# Altium schematic sheet Sheet1.SchDoc
size A3; SheetNumber: 1; SheetTotal: 1
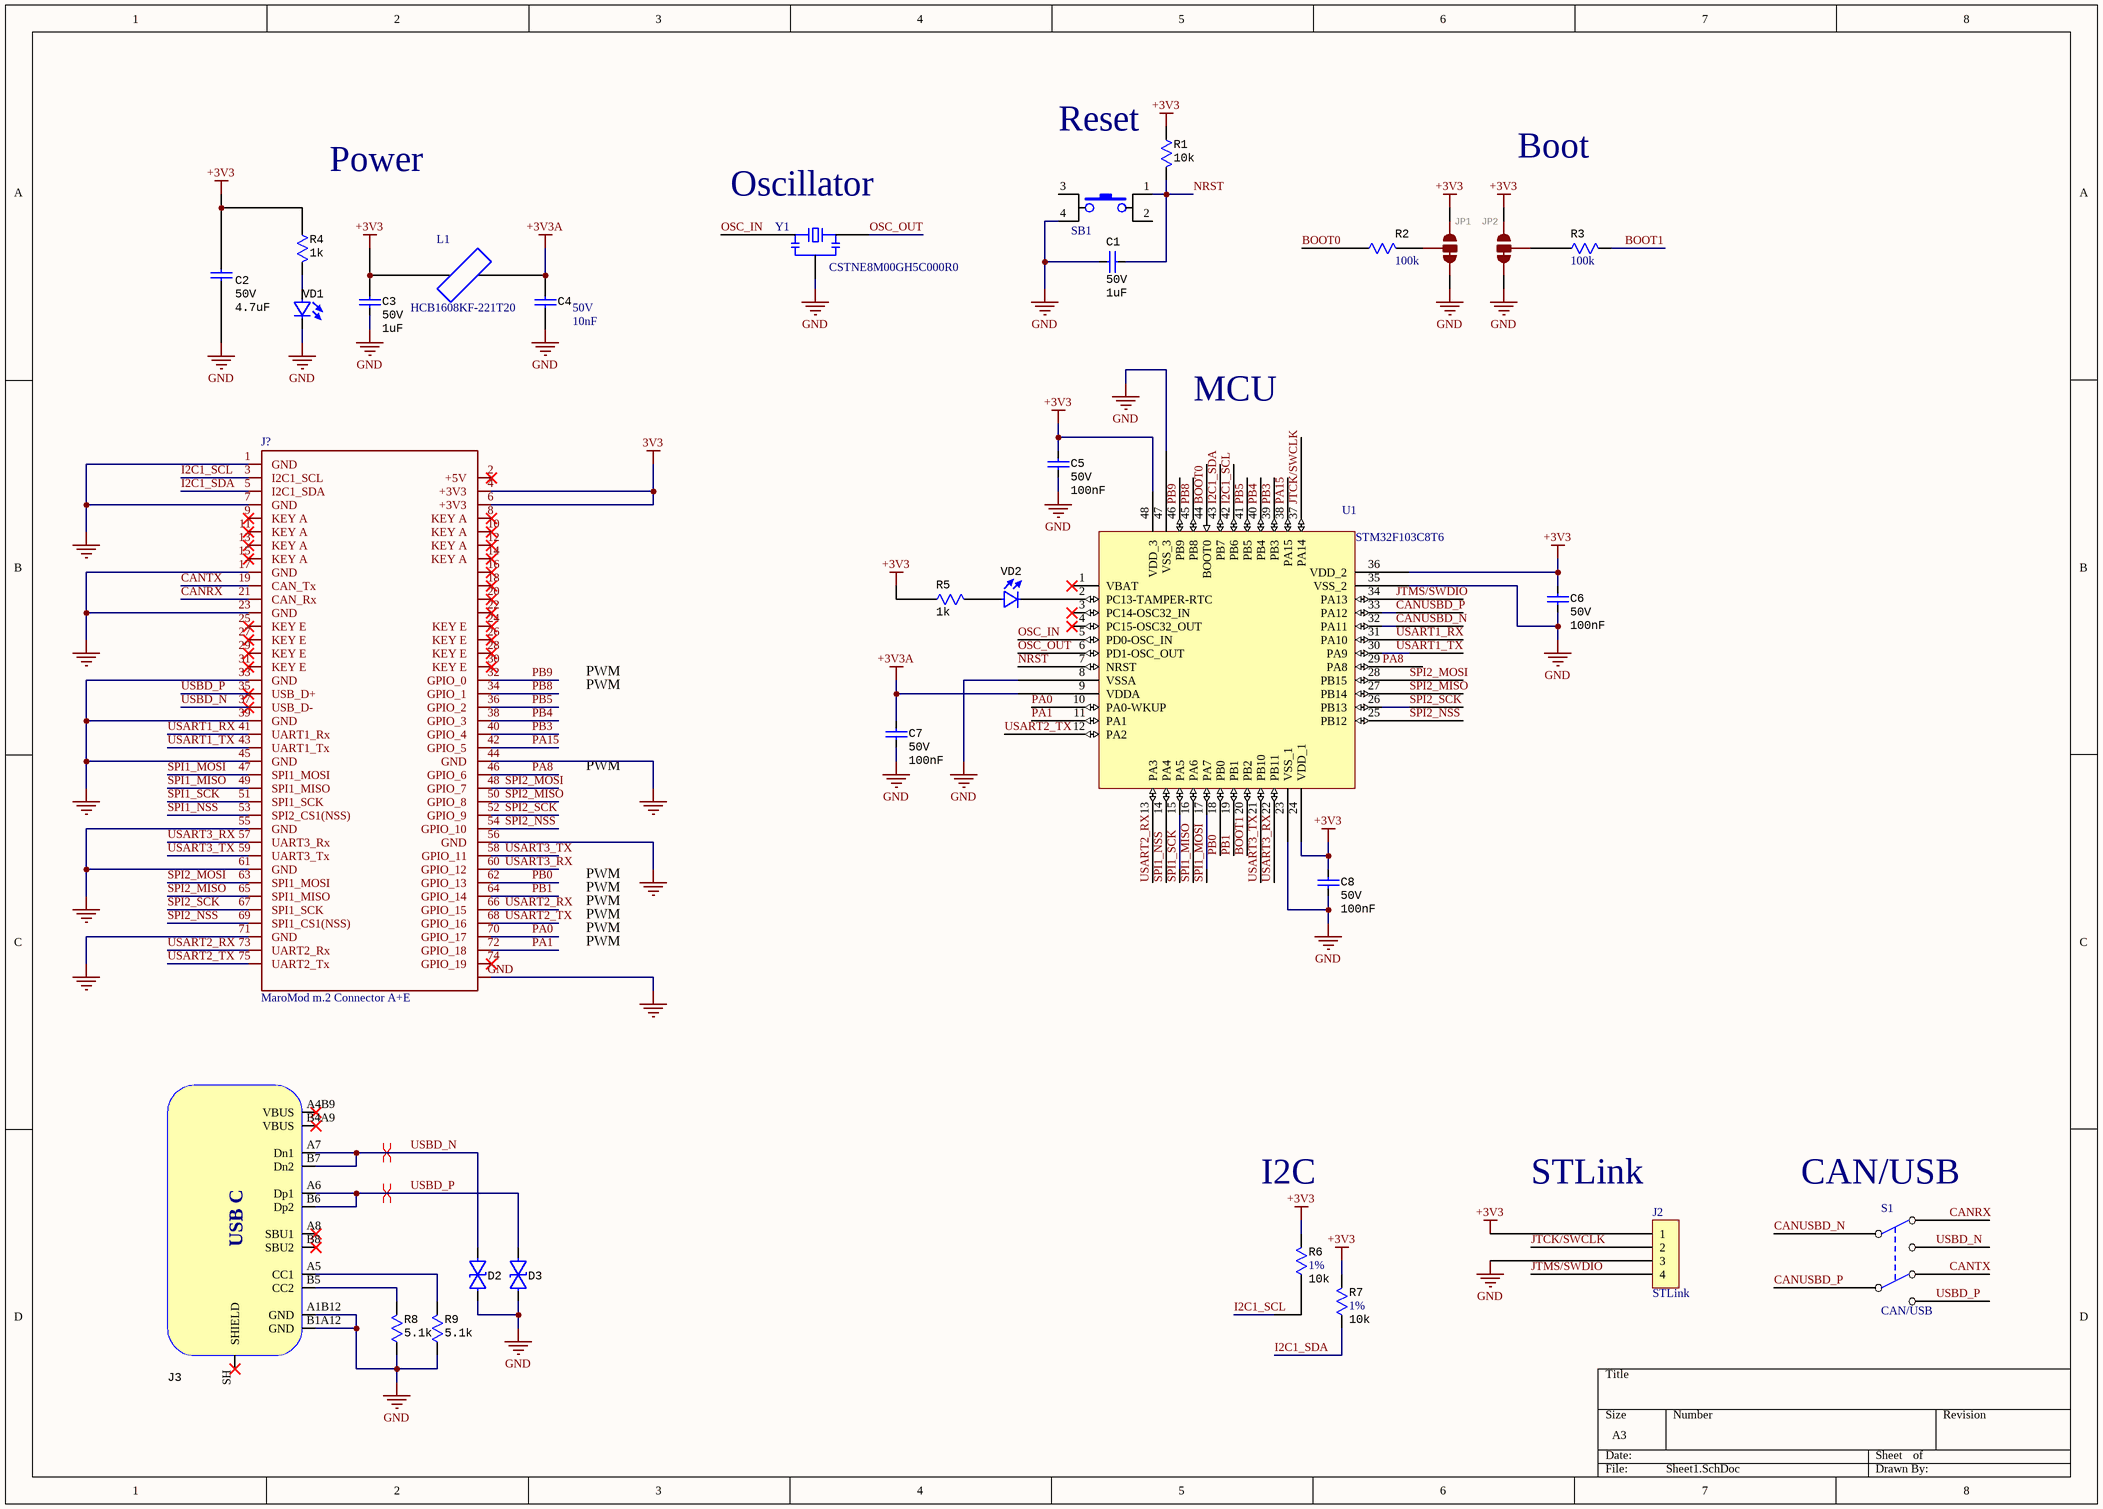
[diagram p0: Sheet1.SchDoc]

## Parts
C1  value 1uF  Voltage: 50V  [CAP Ceramic SMD 0603]  (hidden comment: CAP 0603 1uF 50V)
C2  value 4.7uF  Voltage: 50V  [CAP Ceramic SMD 1206]  (hidden comment: CAP 1206 4.7uF 50V)
C3  value 1uF  Voltage: 50V  [CAP Ceramic SMD 0603]  (hidden comment: CAP 0603 1uF 50V)
C4  10nF  Voltage Rating (DC): 50V  [CAP Ceramic SMD 0603]
C5  value 100nF  Voltage: 50V  [CAP Ceramic SMD 0603]  (hidden comment: CAP 0603 100nF 50V)
C6  value 100nF  Voltage: 50V  [CAP Ceramic SMD 0603]  (hidden comment: CAP 0603 100nF 50V)
C7  value 100nF  Voltage: 50V  [CAP Ceramic SMD 0603]  (hidden comment: CAP 0603 100nF 50V)
C8  value 100nF  Voltage: 50V  [CAP Ceramic SMD 0603]  (hidden comment: CAP 0603 100nF 50V)
D2  (no value)  [Diode Single SMD SOD523]
D3  (no value)  [Diode Single SMD SOD523]
J2  STLink  [XH-4/2.5mm]
J3  Connector_USB_Type_C_12Pin  [USB-C-31-M-12 (12PIN)]  (value not drawn)
J?  MaroMod m.2 Connector A+E  [KEY A+E Screw]  (no BOM)
JP1  JUMPER-SMT_3_1-NC_TRACE_NO-SILK  [SMT-JUMPER_3_1-NC_TRACE_NO-SILK]  (value not drawn)
JP2  JUMPER-SMT_3_1-NC_TRACE_NO-SILK  [SMT-JUMPER_3_1-NC_TRACE_NO-SILK]  (value not drawn)
L1  HCB1608KF-221T20  [HCB1608KF-221T20]
R1  value 10k  [RES SMD 0603]  (hidden comment: RES 0603 10k 1%)
R2  100k  [RES SMD 0603]
R3  100k  [RES SMD 0603]
R4  value 1k  [RES SMD 0603]  (hidden comment: RES 0603 1k 1%)
R5  value 1k  [RES SMD 0603]  (hidden comment: RES 0603 1k 1%)
R6  value 10k  Tolerance: 1%  [RES SMD 0603]  (hidden comment: RES 0603 10k 1%)
R7  value 10k  Tolerance: 1%  [RES SMD 0603]  (hidden comment: RES 0603 10k 1%)
R8  value 5.1k  [RES SMD 0603]  (hidden comment: 5.1kR)
R9  value 5.1k  [RES SMD 0603]  (hidden comment: 5.1kR)
S1  CAN/USB  [SWP-SS-22H07-G5]
SB1  TS-1187A-B-A-B  [SW-SMD-4X4X1.5]  (value not drawn)
U1  STM32F103C8T6  [STM-LQFP48_N]
VD1  (no value)  [LED SMD 0805R]
VD2  (no value)  [LED SMD 0805G]
Y1  CSTNE8M00GH5C000R0  [Crystal SMD 3-PIN 3213-3P]

## Nets
3V3: J?.4(+3V3) J?.6(+3V3)
+3V3: C2.1 C3.1 C5.1 C6.1 C8.1 J2.1 JP1.1 JP2.1 L1.2 R1.1 R4.1 R5.1 R6.2 R7.2 U1.24(VDD_1) U1.36(VDD_2) U1.48(VDD_3)
+3V3A: C4.1 C7.1 L1.1 U1.9(VDDA)
GND: C1.2 C2.2 C3.2 C4.2 C5.2 C6.2 C7.2 C8.2 D2.1 D3.1 J2.3 J3.A1B12(GND) J3.B1A12(GND) J?.1(GND) J?.7(GND) J?.17(GND) J?.23(GND) J?.33(GND) J?.39(GND) J?.44(GND) J?.45(GND) J?.55(GND) J?.56(GND) J?.61(GND) J?.71(GND) J?.GND JP1.3 JP2.3 R8.1 R9.1 SB1.4 U1.8(VSSA) U1.23(VSS_1) U1.35(VSS_2) U1.47(VSS_3) VD1.2 Y1.2
BOOT0: R2.1 U1.44(BOOT0)
BOOT1: R3.1 U1.20(PB2)
CANRX: J?.21(CAN_Rx) S1.1
CANTX: J?.19(CAN_Tx) S1.6
CANUSBD_N: S1.2 U1.32(PA11)
CANUSBD_P: S1.5 U1.33(PA12)
I2C1_SCL: J?.3(I2C1_SCL) R6.1 U1.42(PB6)
I2C1_SDA: J?.5(I2C1_SDA) R7.1 U1.43(PB7)
JTCK/SWCLK: J2.2 U1.37(PA14)
JTMS/SWDIO: J2.4 U1.34(PA13)
NRST: C1.1 R1.2 SB1.1 U1.7(NRST)
OSC_IN: U1.5(PD0-OSC_IN) Y1.1
OSC_OUT: U1.6(PD1-OSC_OUT) Y1.3
PA0: J?.70(GPIO_17) U1.10(PA0-WKUP)
PA1: J?.72(GPIO_18) U1.11(PA1)
PA8: J?.46(GPIO_6) U1.29(PA8)
PA15: J?.42(GPIO_5) U1.38(PA15)
PB0: J?.62(GPIO_13) U1.18(PB0)
PB1: J?.64(GPIO_14) U1.19(PB1)
PB3: J?.40(GPIO_4) U1.39(PB3)
PB4: J?.38(GPIO_3) U1.40(PB4)
PB5: J?.36(GPIO_2) U1.41(PB5)
PB8: J?.34(GPIO_1) U1.45(PB8)
PB9: J?.32(GPIO_0) U1.46(PB9)
SPI1_MISO: J?.49(SPI1_MISO) U1.16(PA6)
SPI1_MOSI: J?.47(SPI1_MOSI) U1.17(PA7)
SPI1_NSS: J?.53(SPI2_CS1(NSS)) U1.14(PA4)
SPI1_SCK: J?.51(SPI1_SCK) U1.15(PA5)
SPI2_MISO: J?.50(GPIO_8) J?.65(SPI1_MISO) U1.27(PB14)
SPI2_MOSI: J?.48(GPIO_7) J?.63(SPI1_MOSI) U1.28(PB15)
SPI2_NSS: J?.54(GPIO_10) J?.69(SPI1_CS1(NSS)) U1.25(PB12)
SPI2_SCK: J?.52(GPIO_9) J?.67(SPI1_SCK) U1.26(PB13)
USART1_RX: J?.41(UART1_Rx) U1.31(PA10)
USART1_TX: J?.43(UART1_Tx) U1.30(PA9)
USART2_RX: J?.66(GPIO_15) J?.73(UART2_Rx) U1.13(PA3)
USART2_TX: J?.68(GPIO_16) J?.75(UART2_Tx) U1.12(PA2)
USART3_RX: J?.57(UART3_Rx) J?.60(GPIO_12) U1.22(PB11)
USART3_TX: J?.58(GPIO_11) J?.59(UART3_Tx) U1.21(PB10)
USBD_N: D2.2 J3.A7(Dn1) J3.B7(Dn2) J?.37(USB_D-) S1.3
USBD_P: D3.2 J3.A6(Dp1) J3.B6(Dp2) J?.35(USB_D+) S1.4
NetJ3_A5: J3.A5(CC1) R9.2
NetJ3_B5: J3.B5(CC2) R8.2
NetJP1_2: JP1.2 R2.2
NetJP2_2: JP2.2 R3.2
NetR4_2: R4.2 VD1.1
NetR5_2: R5.2 VD2.1
NetU1_2: U1.2(PC13-TAMPER-RTC) VD2.2

Not connected (* = marked no-connect by the designer): J3 A4B9(VBUS)* A8(SBU1)* B4A9(VBUS)* B8(SBU2)* SH(SHIELD)*; J? 2(+5V)* 8(KEY_A)* 9(KEY_A)* 10(KEY_A)* 11(KEY_A)* 12(KEY_A)* 13(KEY_A)* 14(KEY_A)* 15(KEY_A)* 16* 18* 20* 22* 24(KEY_E)* 25(KEY_E)* 26(KEY_E)* 27(KEY_E)* 28(KEY_E)* 29(KEY_E)* 30(KEY_E)* 31(KEY_E)* 74(GPIO_19)*; SB1 2 3; U1 1(VBAT)* 3(PC14-OSC32_IN)* 4(PC15-OSC32_OUT)*

## Layout directives
differential pair: USBD_N, USBD_P

## Notes on the sheet
- Power
- (near R1) Reset
- Boot
- (near Y1) Oscillator
- MCU
- PWM
- (near R6) I2C
- (near J2) STLink
- (near S1) CAN/USB
- (in symbol Connector_USB_Type_C_12Pin) USB C

## Library data of the parts
C1 C3 = CAP 0603 1uF 50V: 0603 1 uF 50 V ±10% Tolerance X5R SMT Multilayer Ceramic Capacitor; Manufacturer: Murata; Manufacturer Part Number: GRM188R61H105KAALD; Dielectric: X7R; Tolerance: 10%; Supplier 1: LCSC; Supplier Part Number 1: C77386; RoHS: Yes; Category: Ceramic Capacitors; Stock 1: 2200; Pricing 1: 50=0.01970, 500=0.01600, 1500=0.01390, 5000=0.01050, 25000=0.00960, 50000=0.00910 (USD); Mount: Surface Mount; Case/Package: 0603; Case Code (Imperial): 0603; Case Code (Metric): 1608; Min Operating Temperature: -55°C; Max Operating Temperature: 85°C; Capacitance: 1uF; Voltage Rating: 50V; Voltage Rating (DC): 50V; Packaging: Tape and Reel; Package Quantity: 4000; Termination: SMD/SMT; Series: GRM; Construction: Flat; Length: 1.6mm; Width: 0.8mm; Height: 0.8mm; Thickness: 0.035inch; Depth: 0.8mm; Radiation Hardening: No; RoHS Compliant: Yes; REACH SVHC: No SVHC; ComponentLink1URL: https://datasheet.ciiva.com/23628/1522414-23628576.pdf?src-supplier=Newark; ComponentLink1Description: https://datasheet.ciiva.com/23628/1522414-23628576.pdf?src-supplier=Newark; ComponentLink2URL: https://datasheet.ciiva.com/22706/1747450-22706788.pdf?src-supplier=Element14; ComponentLink2Description: https://datasheet.ciiva.com/22706/1747450-22706788.pdf?src-supplier=Element14; ComponentLink3URL: https://datasheet.ciiva.com/14116/grmseries-highdielectrictype-eng-14116381.pdf?src-supplier=Distrelec; ComponentLink3Description: https://datasheet.ciiva.com/14116/grmseries-highdielectrictype-eng-14116381.pdf?src-supplier=Distrelec; Weight: 0.000222oz; Resistor Type: Ceramic; Lead Free: Lead Free; ComponentLink4URL: https://datasheet.ciiva.com/7719/1747450-7719046.pdf?src-supplier=Element14; ComponentLink4Description: https://datasheet.ciiva.com/7719/1747450-7719046.pdf?src-supplier=Element14; Material: Ceramic
C2 = CAP 1206 4.7uF 50V: CAP CER 4.7UF 50V X7R 1206; Manufacturer: Murata; Manufacturer Part Number: GRM31CR71H475KA12L; Tolerance: 10%; Material: Ceramic; Supplier 1: Arrow Electronics; RoHS: Yes; Category: Ceramic Capacitors; Stock 1: 80556; Pricing 1: 1=0.38790, 10=0.28280, 25=0.25560, 100=0.19830, 250=0.18090, 500=0.15290, 1000=0.12970, 3000=0.09130, 6000=0.08180, 15000=0.08090, 30000=0.07980, 75000=0.07380 (USD); Mount: Surface Mount; Case/Package: 1206; Case Code (Metric): 3216; Case Code (Imperial): 1206; Min Operating Temperature: -55°C; Max Operating Temperature: 125°C; Package Quantity: 2000; Capacitance: 4.7uF; Voltage Rating: 50V; Packaging: Tape and Reel; Series: GRM; Length: 3.2mm; Width: 0.063inch; Lead Free: Lead Free; RoHS Compliant: Yes; ComponentLink1URL: https://datasheet.ciiva.com/6072/415379-6072784.pdf?src-supplier=Farnell; ComponentLink1Description: https://datasheet.ciiva.com/6072/415379-6072784.pdf?src-supplier=Farnell; ComponentLink2URL: https://datasheet.ciiva.com/3777/2267grm31cr71h475ka1223-3777241.pdf?src-supplier=Arrow+Electronics; ComponentLink2Description: https://datasheet.ciiva.com/3777/2267grm31cr71h475ka1223-3777241.pdf?src-supplier=Arrow+Electronics; ComponentLink3URL: https://datasheet.ciiva.com/29202/450972-da-01-de-vs-chip-kond-1206-4-7-uf-10pr-50-0v-x7r-29202576.pdf?src-supplier=Conrad; ComponentLink3Description: https://datasheet.ciiva.com/29202/450972-da-01-de-vs-chip-kond-1206-4-7-uf-10pr-50-0v-x7r-29202576.pdf?src-supplier=Conrad; Voltage Rating (DC): 50V; Dielectric: X7R; Termination: SMD/SMT; Construction: Flat; Height: 1.6mm; Thickness: 0.071inch; Depth: 1.6mm; Radiation Hardening: No; REACH SVHC: No SVHC; ComponentLink4URL: https://datasheet.ciiva.com/29202/451279-da-01-de-vs-kondens-grm31-cr71h-475ka12l-29202365.pdf?src-supplier=Conrad; ComponentLink4Description: https://datasheet.ciiva.com/29202/451279-da-01-de-vs-kondens-grm31-cr71h-475ka12l-29202365.pdf?src-supplier=Conrad; ComponentLink5URL: https://datasheet.ciiva.com/7937/415310-7937749.pdf?src-supplier=Element14; ComponentLink5Description: https://datasheet.ciiva.com/7937/415310-7937749.pdf?src-supplier=Element14; ComponentLink6URL: https://datasheet.ciiva.com/6270/partnumbering-e-01-6270218.pdf?src-supplier=Digi-Key; ComponentLink6Description: https://datasheet.ciiva.com/6270/partnumbering-e-01-6270218.pdf?src-supplier=Digi-Key; ComponentLink7URL: https://datasheet.ciiva.com/6270/partnumbering-e-01-6270217.pdf?src-supplier=Digi-Key; ComponentLink7Description: https://datasheet.ciiva.com/6270/partnumbering-e-01-6270217.pdf?src-supplier=Digi-Key; ComponentLink8URL: https://datasheet.ciiva.com/6270/partnumbering-e-01-6270219.pdf?src-supplier=Digi-Key; ComponentLink8Description: https://datasheet.ciiva.com/6270/partnumbering-e-01-6270219.pdf?src-supplier=Digi-Key; Supplier Part Number 1: GRM31CR71H475KA12L; Supplier 2: LCSC; Stock 2: 656560; Pricing 2: 10=0.05080, 100=0.04090, 300=0.03590, 1000=0.03170, 5000=0.03030, 10000=0.02930 (USD); Supplier Part Number 2: C77096
C4 = CAP 0603 10nF 50V: 0603 10nF 50V ±10% Tolerance X7R Surface Mount Multilayer Ceramic Capacitor; Manufacturer: Kyocera AVX; Manufacturer Part Number: 06035C103K4T2A; Dissipation Factor: 2.5%; Supplier 1: LCSC; RoHS: Yes; Category: Ceramic Capacitors; Stock 1: 4600; Pricing 1: 50=0.012500, 500=0.010300, 1500=0.009100, 5000=0.008400, 25000=0.007800, 50000=0.007400 (AUD); Case/Package: 0603; Case Code (Imperial): 0603; Case Code (Metric): 1608; Min Operating Temperature: -55°C; Max Operating Temperature: 125°C; Tolerance: 10%; Packaging: Tape and Reel; Dielectric: X7R; Termination: SMD/SMT; Series: -; Length: 1.6mm; Width: 0.032inch; RoHS Compliant: Yes; ComponentLink1URL: https://datasheet.ciiva.com/16425/cauto-16425973.pdf?src-supplier=Future+Electronics; ComponentLink1Description: https://datasheet.ciiva.com/16425/cauto-16425973.pdf?src-supplier=Future+Electronics; Capacitance: 10nF; ComponentLink2Description: https://datasheet.ciiva.com/206/cauto-206886.pdf?src-supplier=Digi-Key; ComponentLink2URL: https://datasheet.ciiva.com/206/cauto-206886.pdf?src-supplier=Digi-Key; ComponentLink3Description: https://datasheet.ciiva.com/7614/cauto-7614648.pdf?src-supplier=Digi-Key; ComponentLink3URL: https://datasheet.ciiva.com/7614/cauto-7614648.pdf?src-supplier=Digi-Key; ComponentLink4Description: https://datasheet.ciiva.com/14891/cauto-14891051.pdf?src-supplier=Digi-Key; ComponentLink4URL: https://datasheet.ciiva.com/14891/cauto-14891051.pdf?src-supplier=Digi-Key; ComponentLink5Description: https://datasheet.ciiva.com/7855/88813-7855228.pdf?src-supplier=Element14; ComponentLink5URL: https://datasheet.ciiva.com/7855/88813-7855228.pdf?src-supplier=Element14; ComponentLink6Description: https://datasheet.ciiva.com/14891/cauto-14891052.pdf?src-supplier=Digi-Key; ComponentLink6URL: https://datasheet.ciiva.com/14891/cauto-14891052.pdf?src-supplier=Digi-Key; ComponentLink7Description: https://datasheet.ciiva.com/11499/cauto-11499678.pdf?src-supplier=Avnet; ComponentLink7URL: https://datasheet.ciiva.com/11499/cauto-11499678.pdf?src-supplier=Avnet; Construction: Flat; Contact Plating: Tin,Matte; Depth: 0.81mm; Height: 0.9mm; Lead Free: Lead Free; Mount: Surface Mount; Number of Pins: 2; Package Quantity: 1; Radiation Hardening: No; Ratings: AEC-Q200; REACH SVHC: No SVHC; Supplier Part Number 1: C513325; Thickness: 0.035inch; Voltage Rating: 50V
C5-C8 = CAP 0603 100nF 50V: Multilayer Ceramic Capacitors MLCC Surface Mount 0603 0.1uF 50 Volts X7R 10%; Manufacturer: Murata; Manufacturer Part Number: GRM188R71H104KA93D; Insulation Resistance: 10GR; Supplier 1: LCSC; RoHS: Yes; Category: Ceramic Capacitors; Stock 1: 3546650; Pricing 1: 50=0.00420, 500=0.00330, 1500=0.00290, 5000=0.00260, 25000=0.00250, 50000=0.00240 (USD); Mount: Surface Mount; Case/Package: 0603; Number of Pins: 2; Case Code (Metric): 1608; Case Code (Imperial): 0603; Dielectric Material: Ceramic; Min Operating Temperature: -55°C; Max Operating Temperature: 125°C; Capacitance: 100nF; Tolerance: 10%; Packaging: Tape and Reel; Dielectric: X7R; Termination: SMD/SMT; Package Quantity: 1; Voltage Rating: 50V; Length: 1.6mm; Width: 0.8mm; Height: 0.8mm; Depth: 0.8mm; Thickness: 0.035inch; Radiation Hardening: No; RoHS Compliant: Yes; REACH SVHC: No SVHC; Lead Free: Lead Free; ComponentLink1URL: https://datasheet.ciiva.com/19467/1857604-19467681.pdf?src-supplier=Jameco; ComponentLink1Description: https://datasheet.ciiva.com/19467/1857604-19467681.pdf?src-supplier=Jameco; ComponentLink2URL: https://datasheet.ciiva.com/11786/0900766b807a1cab-11786047.pdf?src-supplier=RSComponents; ComponentLink2Description: https://datasheet.ciiva.com/11786/0900766b807a1cab-11786047.pdf?src-supplier=RSComponents; ComponentLink3URL: https://datasheet.ciiva.com/29201/451744-da-01-en-vs-kondensator-0603-29201904.pdf?src-supplier=Conrad; ComponentLink3Description: https://datasheet.ciiva.com/29201/451744-da-01-en-vs-kondensator-0603-29201904.pdf?src-supplier=Conrad; ComponentLink4URL: https://datasheet.ciiva.com/7937/4360-7937659.pdf?src-supplier=Element14; ComponentLink4Description: https://datasheet.ciiva.com/7937/4360-7937659.pdf?src-supplier=Element14; ComponentLink5URL: https://datasheet.ciiva.com/14116/nmgrm-data-en-14116602.pdf?src-supplier=Distrelec; ComponentLink5Description: https://datasheet.ciiva.com/14116/nmgrm-data-en-14116602.pdf?src-supplier=Distrelec; ComponentLink6URL: https://datasheet.ciiva.com/48436/nmgrm-data-en-48436667.pdf?src-supplier=Distrelec; ComponentLink6Description: https://datasheet.ciiva.com/48436/nmgrm-data-en-48436667.pdf?src-supplier=Distrelec; ComponentLink7URL: https://datasheet.ciiva.com/28534/4360-28534245.pdf?src-supplier=Element14; ComponentLink7Description: https://datasheet.ciiva.com/28534/4360-28534245.pdf?src-supplier=Element14; ComponentLink8URL: https://datasheet.ciiva.com/131/partnumbering-e-01-131739.pdf?src-supplier=Digi-Key; ComponentLink8Description: https://datasheet.ciiva.com/131/partnumbering-e-01-131739.pdf?src-supplier=Digi-Key; ComponentLink9URL: https://datasheet.ciiva.com/131/partnumbering-e-01-131738.pdf?src-supplier=Digi-Key; ComponentLink9Description: https://datasheet.ciiva.com/131/partnumbering-e-01-131738.pdf?src-supplier=Digi-Key; Supplier Part Number 1: C77055; ComponentLink10Description: https://datasheet.ciiva.com/131/partnumbering-e-01-131740.pdf?src-supplier=Digi-Key; ComponentLink10URL: https://datasheet.ciiva.com/131/partnumbering-e-01-131740.pdf?src-supplier=Digi-Key; ComponentLink11Description: https://datasheet.ciiva.com/7937/1747470-7937658.pdf?src-supplier=Element14; ComponentLink11URL: https://datasheet.ciiva.com/7937/1747470-7937658.pdf?src-supplier=Element14; Contact Plating: Tin,Matte; Material: Ceramic; Voltage Rating (DC): 50V
D2 D3 = LESD5D5.0CT1G: Bi-Directional 9.4A 5V 18.6V 5.6V SOD-523 ESD Protection Devices ROHS; Manufacturer: UMW(Youtai Semiconductor); Supplier 1: LCSC; Manufacturer Part Number: LESD5D5.0CT1G; RoHS: No; Category: Uncategorized; Stock 1: 13940; Pricing 1: 20=0.02140, 200=0.01710, 600=0.01470, 3000=0.01330, 9000=0.01330, 21000=0.01330 (USD); Supplier Part Number 1: C5199850
J2 = JST 4: MaleHeader 4x1
J3 = Connector_USB_Type_C_12Pin: Korean Hroparts Elec / USB-Type-C / Num of contacts 16 / Surface Mount; ManufacturerPartNumber: TYPE-C-31-M-12; SuplierPartNumber: C165948; TypeConnector: USB Type C; CurrentMax: 3A; Manufacturer: Korean Hroparts; HelpURL: https://lcsc.com/product-detail/USB-Type-C_Korean-Hroparts-Elec-TYPE-C-31-M-12_C165948.html
JP1 JP2 = JUMPER-SMT_3_1-NC_TRACE_NO-SILK: Normally closed trace jumper (1 of 2 connections)    This jumper has a trace between two pads so it's normally closed (NC). The other connection is normally open (NO). Use a razor knife to open the connection. For best results follow the IPC guidelines for cutting traces: Cutout at least 0.063 mm (0.005 in).  Remove all loose material to clean up the cut area.  Seal the cut with an approved epoxy.       Reapply solder to reclose the connection, or to close the NO connection.; GateName_1: G$1; SymbolName_1: SMT-JUMPER_3_1-NC_TRACE; DeviceName: _NO-SILK; LibraryName: SparkFun-Jumpers; DeviceSetName: JUMPER-SMT_3_1-NC_TRACE; Package: SMT-JUMPER_3_1-NC_TRACE_NO-SILK
L1 = Ferrite-Bead: 2A 1 100mΩ 220Ω@100MHz ±25% 0603 Ferrite Beads ROHS; Manufacturer: TAI-TECH; Package: 0603; ComponentLink1Description: LCSC; ComponentLink1URL: https://www.lcsc.com/product-detail/Ferrite-Beads_TAI-TECH-HCB1608KF-221T20_C304314.html; Part Number: HCB1608KF-221T20; Supplier: LCSC; Supplier part number: C304314
R1 R6 R7 = RES 0603 10k 1%: Res Thick Film 0603 10K Ohm 1% 1/10W ±100ppm/°C Molded SMD Punched Carrier T/R; Manufacturer: Panasonic; Manufacturer Part Number: ERJ-3EKF1002V; Power Rating: 100mW; Resistance: 10kR; Voltage Rating: 75V; Supplier 1: LCSC; Supplier Part Number 1: C191124; RoHS: Yes; Category: Chip SMD Resistors; Stock 1: 555600; Pricing 1: 50=0.010200, 500=0.008400, 1500=0.007300, 5000=0.006100, 25000=0.005500, 50000=0.005400 (AUD); Mount: Surface Mount; Case/Package: 0603; Number of Pins: 2; Case Code (Imperial): 0603; Case Code (Metric): 1608; Contact Plating: Tin; Size Code: 0603; Min Operating Temperature: -55°C; Max Operating Temperature: 155°C; Temperature Coefficient: 100ppm/°C; Packaging: Tape and Reel; Resistor Type: Thick Film; Series: ERJ; Package Quantity: 1; Termination: SMD/SMT; Voltage Rating (DC): 75V; Number of Terminations: 2; Max Power Dissipation: 100mW; Construction: Rectangular; Resistance Tolerance: 1%; Features: Automotive AEC-Q200; Technology: THICK FILM; Length: 1.6mm; Width: 0.031inch; Height: 0.45mm; Depth: 0.8mm; Radiation Hardening: No; RoHS Compliant: Yes; REACH SVHC: No SVHC; Lead Free: Lead Free; Military Standard: Not; ComponentLink1URL: https://datasheet.ciiva.com/7830/aoa0000ce2-7830729.pdf?src-supplier=Element14; ComponentLink1Description: https://datasheet.ciiva.com/7830/aoa0000ce2-7830729.pdf?src-supplier=Element14; ComponentLink2URL: https://datasheet.ciiva.com/46372/1678782-46372725.pdf?src-supplier=Element14; ComponentLink2Description: https://datasheet.ciiva.com/46372/1678782-46372725.pdf?src-supplier=Element14; ComponentLink3URL: https://datasheet.ciiva.com/28514/426256-28514198.pdf?src-supplier=Element14; ComponentLink3Description: https://datasheet.ciiva.com/28514/426256-28514198.pdf?src-supplier=Element14; ComponentLink4URL: https://datasheet.ciiva.com/24070/aoa0000ce2-24070318.pdf?src-supplier=Mouser; ComponentLink4Description: https://datasheet.ciiva.com/24070/aoa0000ce2-24070318.pdf?src-supplier=Mouser; ComponentLink5URL: https://datasheet.ciiva.com/16759/70260748-16759807.pdf?src-supplier=Allied+Electronics; ComponentLink5Description: https://datasheet.ciiva.com/16759/70260748-16759807.pdf?src-supplier=Allied+Electronics; ComponentLink6URL: https://datasheet.ciiva.com/9194/aoa0000ce2-9194199.pdf?src-supplier=Avnet; ComponentLink6Description: https://datasheet.ciiva.com/9194/aoa0000ce2-9194199.pdf?src-supplier=Avnet; ComponentLink7URL: https://datasheet.ciiva.com/48530/aoa0000ce2-48530988.pdf?src-supplier=Avnet; ComponentLink7Description: https://datasheet.ciiva.com/48530/aoa0000ce2-48530988.pdf?src-supplier=Avnet; ComponentLink8URL: https://datasheet.ciiva.com/30208/aoa0000ce2-30208985.pdf?src-supplier=Onlinecomponents.com; ComponentLink8Description: https://datasheet.ciiva.com/30208/aoa0000ce2-30208985.pdf?src-supplier=Onlinecomponents.com
  R1: Tolerance: 1%
R2 R3 = RES 0603 100k 1%: RES SMD 100K OHM 1% 1/10W 0603; Manufacturer: Panasonic; Manufacturer Part Number: ERJ3EKF1003V; Power Rating: 100mW; Temperature Coefficient: 100ppm/°C; Voltage Rating (DC): 75V; Supplier 1: LCSC; RoHS: Yes; Category: Chip SMD Resistors; Stock 1: 373100; Pricing 1: 50=0.00790, 500=0.00640, 1500=0.00550, 5000=0.00500, 25000=0.00460, 50000=0.00430 (USD); Mount: Surface Mount; Case/Package: 0603; Case Code (Metric): 1608; Case Code (Imperial): 0603; Contact Plating: Tin; Min Operating Temperature: -55°C; Max Operating Temperature: 155°C; Resistance: 100k; Tolerance: 1%; Packaging: Tape and Reel; Resistor Type: Thick Film; Number of Terminations: 2; Max Power Dissipation: 100mW; Features: Automotive AEC-Q200; Series: ERJ; Construction: Rectangular; Length: 1.6mm; Width: 0.8mm; Height: 0.022inch; Depth: 0.8mm; Radiation Hardening: No; Military Standard: Not; Lead Free: Lead Free; RoHS Compliant: Yes; ComponentLink1URL: https://datasheet.ciiva.com/34303/1987476-34303566.pdf?src-supplier=Jameco; ComponentLink1Description: https://datasheet.ciiva.com/34303/1987476-34303566.pdf?src-supplier=Jameco; ComponentLink2Description: https://datasheet.ciiva.com/16770/70260748-16770253.pdf?src-supplier=Allied+Electronics; ComponentLink2URL: https://datasheet.ciiva.com/16770/70260748-16770253.pdf?src-supplier=Allied+Electronics; ComponentLink3Description: https://datasheet.ciiva.com/16740/aoa0000ce2-16740662.pdf?src-supplier=Future+Electronics; ComponentLink3URL: https://datasheet.ciiva.com/16740/aoa0000ce2-16740662.pdf?src-supplier=Future+Electronics; ComponentLink4Description: https://datasheet.ciiva.com/15158/getdatasheetpartid-247527-15158907.pdf?src-supplier=Verical; ComponentLink4URL: https://datasheet.ciiva.com/15158/getdatasheetpartid-247527-15158907.pdf?src-supplier=Verical; ComponentLink5Description: https://datasheet.ciiva.com/30133/aoa0000ce2-30133845.pdf?src-supplier=Onlinecomponents.com; ComponentLink5URL: https://datasheet.ciiva.com/30133/aoa0000ce2-30133845.pdf?src-supplier=Onlinecomponents.com; Number of Pins: 2; Package Quantity: 5000; REACH SVHC: No SVHC; Resistance Tolerance: 1%; Size Code: 0603; Supplier Part Number 1: C189597; Termination: SMD/SMT; Voltage Rating: 75V; Weight: 7.1E-05oz
R4 R5 = RES 0603 1k 1%: Res Thick Film 0603 1K Ohm 1% 1/10W ±100ppm/°C Molded SMD Punched Carrier T/R; Manufacturer: Panasonic; Manufacturer Part Number: ERJ3EKF1001V; Resistance: 1kR; Power Rating: 100mW; Voltage Rating: 75V; Tolerance: 1%; Supplier 1: LCSC; RoHS: Yes; Category: Chip SMD Resistors; Stock 1: 79650; Pricing 1: 50=0.009600, 500=0.008100, 1500=0.007300, 5000=0.006800, 25000=0.006400, 50000=0.006200 (AUD); Case/Package: 0603; Case Code (Imperial): 0603; Case Code (Metric): 1608; Contact Plating: Tin; Size Code: 0603; Min Operating Temperature: -55°C; Max Operating Temperature: 155°C; Packaging: Tape and Reel; Temperature Coefficient: 100ppm/°C; Resistor Type: Thick Film; Series: ERJ; Max Power Dissipation: 100mW; Number of Terminations: 2; Construction: Rectangular; Features: Automotive AEC-Q200; Termination: SMD/SMT; Resistance Tolerance: 1%; Technology: THICK FILM; Length: 1.6mm; Height: 0.45mm; Depth: 0.8mm; Radiation Hardening: No; RoHS Compliant: Yes; Military Standard: Not; Lead Free: Lead Free; REACH SVHC: No SVHC; ComponentLink1URL: https://datasheet.ciiva.com/7942/aoa0000ce2-7942427.pdf?src-supplier=Element14; ComponentLink1Description: https://datasheet.ciiva.com/7942/aoa0000ce2-7942427.pdf?src-supplier=Element14; ComponentLink2URL: https://datasheet.ciiva.com/46373/1678782-46373340.pdf?src-supplier=Element14; ComponentLink2Description: https://datasheet.ciiva.com/46373/1678782-46373340.pdf?src-supplier=Element14; ComponentLink3URL: https://datasheet.ciiva.com/22673/1678782-22673918.pdf?src-supplier=Element14; ComponentLink3Description: https://datasheet.ciiva.com/22673/1678782-22673918.pdf?src-supplier=Element14; ComponentLink4URL: https://datasheet.ciiva.com/46373/1678782-46373339.pdf?src-supplier=Element14; ComponentLink4Description: https://datasheet.ciiva.com/46373/1678782-46373339.pdf?src-supplier=Element14; ComponentLink5URL: https://datasheet.ciiva.com/24070/aoa0000ce2-24070269.pdf?src-supplier=Mouser; ComponentLink5Description: https://datasheet.ciiva.com/24070/aoa0000ce2-24070269.pdf?src-supplier=Mouser; ComponentLink6URL: https://datasheet.ciiva.com/16768/70260748-16768437.pdf?src-supplier=Allied+Electronics; ComponentLink6Description: https://datasheet.ciiva.com/16768/70260748-16768437.pdf?src-supplier=Allied+Electronics; ComponentLink7URL: https://datasheet.ciiva.com/16774/70260748-16774550.pdf?src-supplier=Allied+Electronics; ComponentLink7Description: https://datasheet.ciiva.com/16774/70260748-16774550.pdf?src-supplier=Allied+Electronics; ComponentLink8URL: https://datasheet.ciiva.com/9198/aoa0000ce2-9198923.pdf?src-supplier=Avnet; ComponentLink8Description: https://datasheet.ciiva.com/9198/aoa0000ce2-9198923.pdf?src-supplier=Avnet; Supplier Part Number 1: C118155; ComponentLink9Description: https://datasheet.ciiva.com/16449/aoa0000ce2-16449065.pdf?src-supplier=Future+Electronics; ComponentLink9URL: https://datasheet.ciiva.com/16449/aoa0000ce2-16449065.pdf?src-supplier=Future+Electronics; ComponentLink10Description: https://datasheet.ciiva.com/48530/aoa0000ce2-48530987.pdf?src-supplier=Avnet; ComponentLink10URL: https://datasheet.ciiva.com/48530/aoa0000ce2-48530987.pdf?src-supplier=Avnet; ComponentLink11Description: https://datasheet.ciiva.com/30063/aoa0000ce2-30063390.pdf?src-supplier=Onlinecomponents.com; ComponentLink11URL: https://datasheet.ciiva.com/30063/aoa0000ce2-30063390.pdf?src-supplier=Onlinecomponents.com; Mount: Surface Mount; Number of Pins: 2; Package Quantity: 5000; Voltage Rating (DC): 75V; Width: 0.8mm
R8 R9 = RES 0603 5.1k 1%: Res Thick Film 0603 5.1K Ohm 1% 1/10W ±100ppm/°C Molded SMD SMD Paper T/R; Manufacturer: Vishay; Manufacturer Part Number: CRCW06035K10FKEA; Max Power Dissipation: 100mW; Voltage Rating (DC): 75V; Supplier 1: LCSC; RoHS: Yes; Category: Chip SMD Resistors; Stock 1: 3800; Pricing 1: 50=0.017200, 500=0.013100, 1500=0.011300, 5000=0.010700, 25000=0.009300, 50000=0.009200 (AUD); Mount: Surface Mount; Case/Package: 0603; Case Code (Imperial): 0603; Case Code (Metric): 1608; Contact Plating: Tin; Size Code: 0603; Weight: 7.1E-05oz; Min Operating Temperature: -55°C; Max Operating Temperature: 155°C; Packaging: Tape and Reel; Resistance: 5.1kR; Tolerance: 1%; Temperature Coefficient: 100ppm/°C; Resistor Type: Thick Film; Series: CRCW; Number of Terminations: 2; Package Quantity: 5000; Power Rating: 100mW; Voltage Rating: 75V; Construction: Rectangular; Features: Automotive AEC-Q200; Termination: SMD/SMT; Resistance Tolerance: 1%; Technology: THICK FILM; Length: 1.55mm; Width: 0.85mm; Height: 0.45mm; Depth: 0.85mm; Radiation Hardening: No; RoHS Compliant: Yes; Lead Free: Lead Free; Military Standard: Not; REACH SVHC: Unknown; ComponentLink1URL: https://datasheet.ciiva.com/11809/0900766b80d98afc-11809935.pdf?src-supplier=RSComponents; ComponentLink1Description: https://datasheet.ciiva.com/11809/0900766b80d98afc-11809935.pdf?src-supplier=RSComponents; ComponentLink2URL: https://datasheet.ciiva.com/26314/fld-crcw-e3-data-en-26314742.pdf?src-supplier=Distrelec; ComponentLink2Description: https://datasheet.ciiva.com/26314/fld-crcw-e3-data-en-26314742.pdf?src-supplier=Distrelec; ComponentLink3URL: https://datasheet.ciiva.com/7690/1697337-7690728.pdf?src-supplier=Element14; ComponentLink3Description: https://datasheet.ciiva.com/7690/1697337-7690728.pdf?src-supplier=Element14; ComponentLink4URL: https://datasheet.ciiva.com/7690/1720486-7690873.pdf?src-supplier=Element14; ComponentLink4Description: https://datasheet.ciiva.com/7690/1720486-7690873.pdf?src-supplier=Element14; ComponentLink5URL: https://datasheet.ciiva.com/15159/getdatasheetpartid-32793-15159338.pdf?src-supplier=Verical; ComponentLink5Description: https://datasheet.ciiva.com/15159/getdatasheetpartid-32793-15159338.pdf?src-supplier=Verical; ComponentLink6URL: https://datasheet.ciiva.com/3257/dcrcwe3-3257758.pdf?src-supplier=Avnet; ComponentLink6Description: https://datasheet.ciiva.com/3257/dcrcwe3-3257758.pdf?src-supplier=Avnet; ComponentLink7URL: https://datasheet.ciiva.com/16226/dcrcwe3-16226862.pdf?src-supplier=Future+Electronics; ComponentLink7Description: https://datasheet.ciiva.com/16226/dcrcwe3-16226862.pdf?src-supplier=Future+Electronics; Supplier Part Number 1: C844933
S1 = SS22E01L5: 0.3A Straight DPDT 5.5mm 50V 50V 11mm 6.2mm 0.3A PCPin 10000 Rectangular columnar -40℃~+85℃ Black Plugin Slide Switches ROHS; Manufacturer: XKB Connectivity; Supplier 1: LCSC; Supplier Part Number 1: C609835; Manufacturer Part Number: SS22E01L5; Stock 1: 13410; Pricing 1: 5=0.11870, 50=0.09610, 150=0.08490, 1000=0.06880, 2000=0.06280, 5000=0.05970 (USD)
SB1 = TS-1187A-B-A-B: No NO 50mA 5.1mm 100mΩ 100000 160gf 12V -30℃~+85℃ 5.1mm 1.5mm Golden Round Button Brick nogging SPST SMD Tactile Switches ROHS; Supplier 1: LCSC; Supplier Part Number 1: C318884; Manufacturer: *; Part Number: *; Supplier: *; Supplier part number: *; Manufacturer Part Number: TS-1187A-B-A-B; RoHS: No; Category: Uncategorized; Stock 1: 372850; Pricing 1: 50=0.01550, 500=0.01200, 1500=0.01040, 4000=0.00920, 24000=0.00870, 48000=0.00840 (USD)
U1 = STM32F103C8T6: ARM® Cortex®-M0 STM32F0 Microcontroller IC 32-Bit Single-Core 48MHz 64KB (64K x 8) FLASH 48-LQFP (7x7); Manufacturer: STMicroelectronics; ComponentLink1Description: Link; ComponentLink1URL: https://www.digikey.com/en/products/detail/stmicroelectronics/STM32F030C8T6/4357252?s=N4IgTCBcDaICwE4DsBaAjHADHAzCgcgCIgC6AvkA; Part Number: STM32F103C8T6; Supplier: Digikey; Supplier Part Number: 497-14043-ND
VD1 = LED 0805 Red: Manufacturer: FOSHAN Nationstar Optoelectronics; Manufacturer Part Number: NCD0805R1; Supplier 1: LCSC; Supplier Part Number 1: C84256; RoHS: No; Category: Uncategorized; Stock 1: 1189900; Pricing 1: 50=0.01160, 500=0.00900, 3000=0.00780, 6000=0.00700, 24000=0.00660, 51000=0.00640 (USD)
VD2 = LED 0805 Emerald: Manufacturer: FOSHAN Nationstar Optoelectronics; Manufacturer Part Number: NCD0805G1; Supplier 1: LCSC; Supplier Part Number 1: C84260; RoHS: No; Category: Uncategorized; Stock 1: 432460; Pricing 1: 20=0.01910, 200=0.01510, 600=0.01290, 3000=0.01160, 9000=0.01050, 21000=0.00990 (USD)
Y1 = CSTNE8M00GH5C000R0: Ceramic Resonator 8MHz ±0.07% (Tol) ±0.13% (Stability) 33pF 40Ohm Automotive 3-Pin CSMD T/R; Manufacturer: Murata; Impedance: 40R; Supplier 1: LCSC; Supplier Part Number 1: C341525; Manufacturer Part Number: CSTNE8M00GH5C000R0; RoHS: Yes; Category: Resonators; Stock 1: 5445; Pricing 1: 5=0.31630, 50=0.26490, 150=0.24280, 500=0.15500, 3000=0.14620, 6000=0.14090 (USD); Mount: Surface Mount; Case/Package: SMD/SMT; Min Operating Temperature: -40°C; Max Operating Temperature: 125°C; Resistor Type: Ceramic; Packaging: Tape and Reel; Frequency: 8MHz; Frequency Stability: 0.13%; Frequency Tolerance: 0.07%; Capacitance: 33pF; RoHS Compliant: Yes; ComponentLink1URL: https://www.murata.com/en/products/productdata/8801161773086/SPEC-CSTNE8M00GH5C000R0.pdf?src-supplier=Digi-Key; ComponentLink1Description: https://www.murata.com/en/products/productdata/8801161773086/SPEC-CSTNE8M00GH5C000R0.pdf?src-supplier=Digi-Key